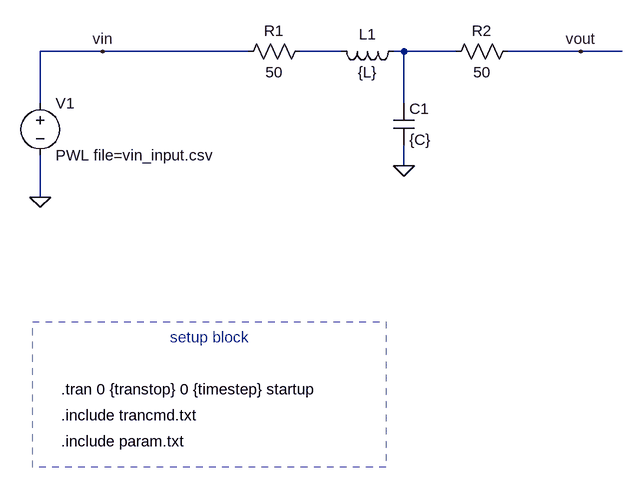
[diagram p0: schematic circuit.asc]
circuit.asc, the LTspice schematic file:
Version 4
SHEET 1 1108 740
WIRE 304 96 208 96
WIRE 528 96 304 96
WIRE 672 96 608 96
WIRE 768 96 752 96
WIRE 848 96 768 96
WIRE 1040 96 928 96
WIRE 1104 96 1040 96
WIRE 208 176 208 96
WIRE 768 176 768 96
WIRE 768 272 768 240
WIRE 208 320 208 256
FLAG 304 96 vin
FLAG 208 320 0
FLAG 1040 96 vout
FLAG 768 272 0
SYMBOL voltage 208 160 R0
WINDOW 39 0 0 Left 0
SYMATTR InstName V1
SYMATTR Value PWL file=vin_input.csv
SYMBOL res 624 80 R90
WINDOW 0 0 56 VBottom 2
WINDOW 3 32 56 VTop 2
SYMATTR InstName R1
SYMATTR Value 50
SYMBOL cap 752 176 R0
SYMATTR InstName C1
SYMATTR Value {C}
SYMBOL ind 768 80 R90
WINDOW 0 5 56 VBottom 2
WINDOW 3 32 56 VTop 2
SYMATTR InstName L1
SYMATTR Value {L}
SYMBOL res 832 112 R270
WINDOW 0 32 56 VTop 2
WINDOW 3 0 56 VBottom 2
SYMATTR InstName R2
SYMATTR Value 50
TEXT 240 616 Left 2 !.tran 0 {transtop} 0 {timestep} startup
TEXT 240 696 Left 2 !.include param.txt
TEXT 240 656 Left 2 !.include trancmd.txt
TEXT 408 536 Left 2 ;setup block
RECTANGLE Normal 740 736 196 512 2

The netlist it stands for:
* circuit.asc
V1 vin 0 PWL file=vin_input.csv
R1 N001 vin 50
C1 N002 0 {C}
L1 N002 N001 {L}
R2 N002 vout 50
.tran 0 {transtop} 0 {timestep} startup
.include param.txt
.include trancmd.txt
* setup block
.backanno
.end